# EAGLE schematic pfeffer_sub_curcuit_2 (EAGLE 8.0.0)
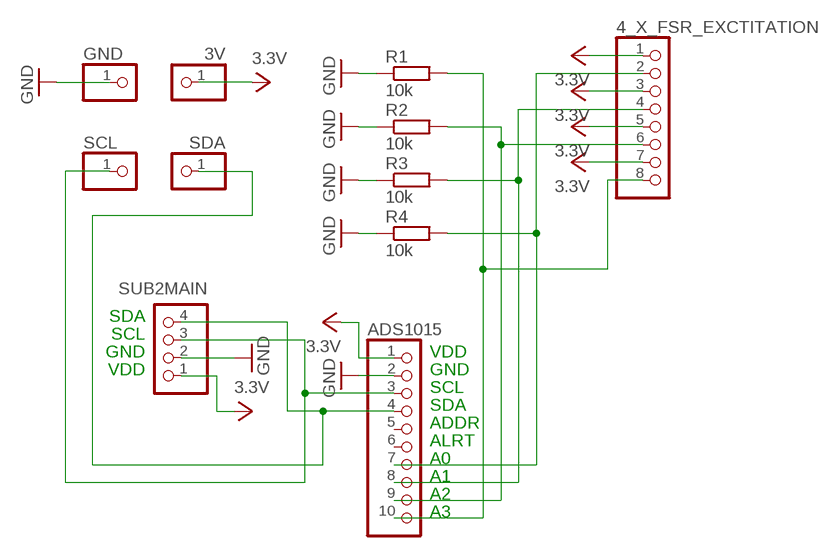
[diagram p0: schematic, sheet 1]

## Parts
3V  PINHD-1X1  [1X01]
4_X_FSR_EXCTITATION  PINHD-1X8  [1X08]
ADS1015  PINHD-1X10  [1X10]
GND  PINHD-1X1  [1X01]
R1  10k  R-EU_0204/7  [0204/7]
R2  10k  R-EU_0204/7  [0204/7]
R3  10k  R-EU_0204/7  [0204/7]
R4  10k  R-EU_0204/7  [0204/7]
SCL  PINHD-1X1  [1X01]
SDA  PINHD-1X1  [1X01]
SUB2MAIN  PINHD-1X4  [1X04]

## Nets
GND: ADS1015.2 GND.1 R1.1 R2.1 R3.1 R4.1 SUB2MAIN.2
N$1: 4_X_FSR_EXCTITATION.8 ADS1015.10 R1.2
N$2: 4_X_FSR_EXCTITATION.6 ADS1015.9 R2.2
N$3: ADS1015.3 SCL.1 SUB2MAIN.3
N$4: ADS1015.4 SDA.1 SUB2MAIN.4
N$5: 4_X_FSR_EXCTITATION.4 ADS1015.8 R3.2
N$6: 4_X_FSR_EXCTITATION.2 ADS1015.7 R4.2
VCC: 3V.1 4_X_FSR_EXCTITATION.1 4_X_FSR_EXCTITATION.3 4_X_FSR_EXCTITATION.5 4_X_FSR_EXCTITATION.7 ADS1015.1 SUB2MAIN.1 ; supply symbol labelled 3.3V
Unconnected: ADS1015.5 ADS1015.6

## Notes on the sheet
- SDA
- SCL
- GND | VDD
- VDD | GND
- SCL
- SDA
- ADDR
- ALRT
- A0
- A1
- A2
- A3

## Library data of the parts
3V GND SCL SDA = adafruit:PINHD-1X1: Pin header 1x1 for 0.1" spacing With round pins
4_X_FSR_EXCTITATION = pinhead:PINHD-1X8: PIN HEADER
ADS1015 = pinhead:PINHD-1X10: PIN HEADER
R1-R4 = rcl:R-EU_: RESISTOR, European symbol
SUB2MAIN = pinhead:PINHD-1X4: PIN HEADER